# Altium schematic sheet Dormio_nrf52.SchDoc
size D
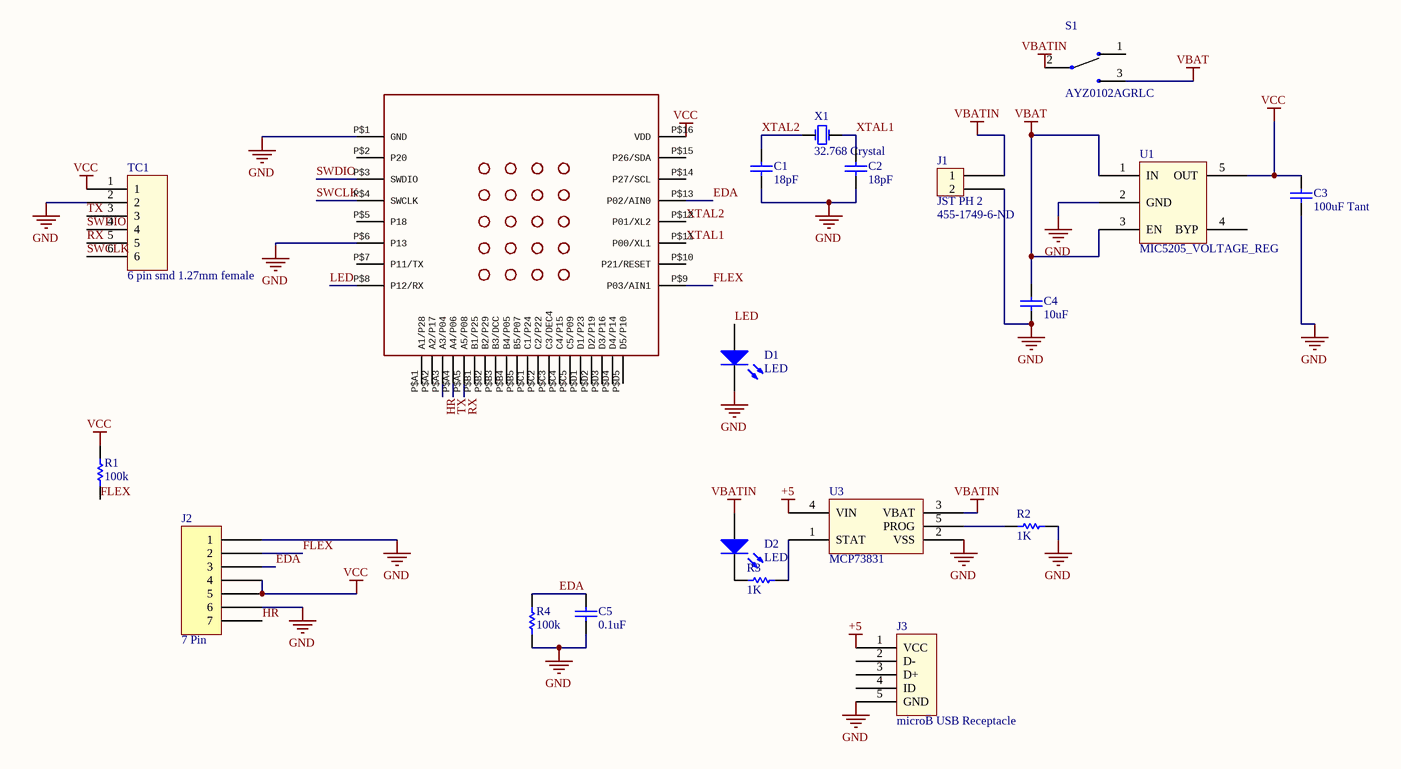
[diagram p0: Dormio_nrf52.SchDoc]

## Parts
C1  18pF  [0603W]
C2  18pF  [0603W]
C3  100uF Tant  [0603W]
C4  10uF  [0603W]
C5  0.1uF  [0603W]
D1  LED  [0603 LED]
D2  LED  [0603 LED]
J1  JST PH 2  Supplier Part Number 1: 455-1749-6-ND  [JST PH 2]
J2  7 Pin  [JST SM07B-GHS-TB]
J3  microB USB Receptacle  [MicroB USB Standarad SMT]
R1  100k  [0603W]
R2  1K  [0603W]
R3  1K  [0603W]
R4  100k  [0603W]
S1  AYZ0102AGRLC  [*SW_AYZ0102AGRLC]
TC1  6 pin smd 1.27mm female  [TC2030-IDC-NL]
U1  MIC5205_VOLTAGE_REG  [SOT-23-5]
U2  B3 DCC ,C3 DEC4 for power saving , 10uH , 15nH  [BC832]  (value not drawn)
U3  MCP73831  [SOT-23-5]
X1  32.768 Crystal  [32.768 Crystal]

## Nets
+5: J3.1(VCC) U3.4(VIN)
GND: C1.2 C2.1 C3.2 C4.2 C5.2 D1.2(K) J1.2 J2.1 J2.6 J3.5(GND) R2.2 R4.1 TC1.2 U1.2(GND) U2.P$1(GND) U2.P$6(P13) U3.2(VSS)
VBAT: C4.1 S1.3 U1.1(IN) U1.3(EN)
VBATIN: D2.1(A) J1.1 S1.2 U3.3(VBAT)
VCC: C3.1 J2.4 J2.5 R1.2 TC1.1 U1.5(OUT) U2.P$16(VDD)
EDA: C5.1 J2.3 R4.2 U2.P$13(P02/AIN0)
FLEX: J2.2 R1.1 U2.P$9(P03/AIN1)
HR: J2.7 U2.P$A3(A3/P04)
LED: D1.1(A) U2.P$8(P12/RX)
RX: TC1.5 U2.P$A5(A5/P08)
SWCLK: TC1.6 U2.P$4(SWCLK)
SWDIO: TC1.4 U2.P$3(SWDIO)
TX: TC1.3 U2.P$A4(A4/P06)
XTAL1: C2.2 U2.P$11(P00/XL1) X1.2
XTAL2: C1.1 U2.P$12(P01/XL2) X1.1
NetD2_2: D2.2(K) R3.1
NetR2_1: R2.1 U3.5(PROG)
NetR3_2: R3.2 U3.1(STAT)

Not connected (* = marked no-connect by the designer): J3 2(D-) 3(D+) 4(ID); S1 1; U1 4(BYP); U2 P$2(P20) P$5(P18) P$7(P11/TX) P$10(P21/RESET) P$14(P27/SCL) P$15(P26/SDA) P$A1(A1/P28) P$A2(A2/P17) P$B1(B1/P25) P$B2(B2/P29) P$B3(B3/DCC) P$B4(B4/P05) P$B5(B5/P07) P$C1(C1/P24) P$C2(C2/P22) P$C3(C3/DEC4) P$C4(C4/P15) P$C5(C5/P09) P$D1(D1/P23) P$D2(D2/P19) P$D3(D3/P16) P$D4(D4/P14) P$D5(D5/P10)

## Library data of the parts
C1 C2 = Capacitor: SMD Cap 0603; digikey part number: *; manufacturer: *; manufacturer part number: *
C3-C5 = Capacitor: SMD Cap 1206; digikey part number: *; manufacturer: *; manufacturer part number: *
D1 D2 = LED: LED SMD 1206/0603; digikey part number: *; manufacturer part number: *; manufacturer: *
J3 = microB USB Receptacle: Manufacturer: ZX62-B-5PA(11); Digikey: H11634CT-ND; digikey part number 2: 609-4613-1-ND
R1-R4 = Resistor: digikey part number: *; manufacturer: *; manufacturer part number: *
S1 = AYZ0102AGRLC: Switch Slide ON ON SPDT Side Slide 0.1A 12VDC 1.2VA 10000Cycles Gull Wing SMD T/R; MF: C&K; SnapEDA_Link: https://www.snapeda.com/parts/AYZ0102AGRLC/C%26K/view-part/?ref=snap; Availability: Unavailable; Price: None; MP: AYZ0102AGRLC; Package: None; Value: *
U1 = MIC5205_VOLTAGE_REG: 5V LDO SMD; Sparkfun #: PRT-1125
U2 = BC832-V1: GateName_1: G$1; SymbolName_1: BC832-V1; LibraryName: BC832; DeviceSetName: BC832-V1; Package: BC832
U3 = MCP73831: IC CONTROLLR LI-ION 4.2V SOT23-5; Manufacturer: MCP73831T-2ACI/OT; Digikey: MCP73831T-2ACI/OTCT-ND
J1 = JST PH 2: Supplier 1: Digikey
TC1 = 6 pin smd 1.27mm female: digikey: S9005E-06-ND
X1 = 32.768 Crystal: digikey number: XC1617CT-ND